# Altium schematic sheet [02] - IO.SchDoc
size A2
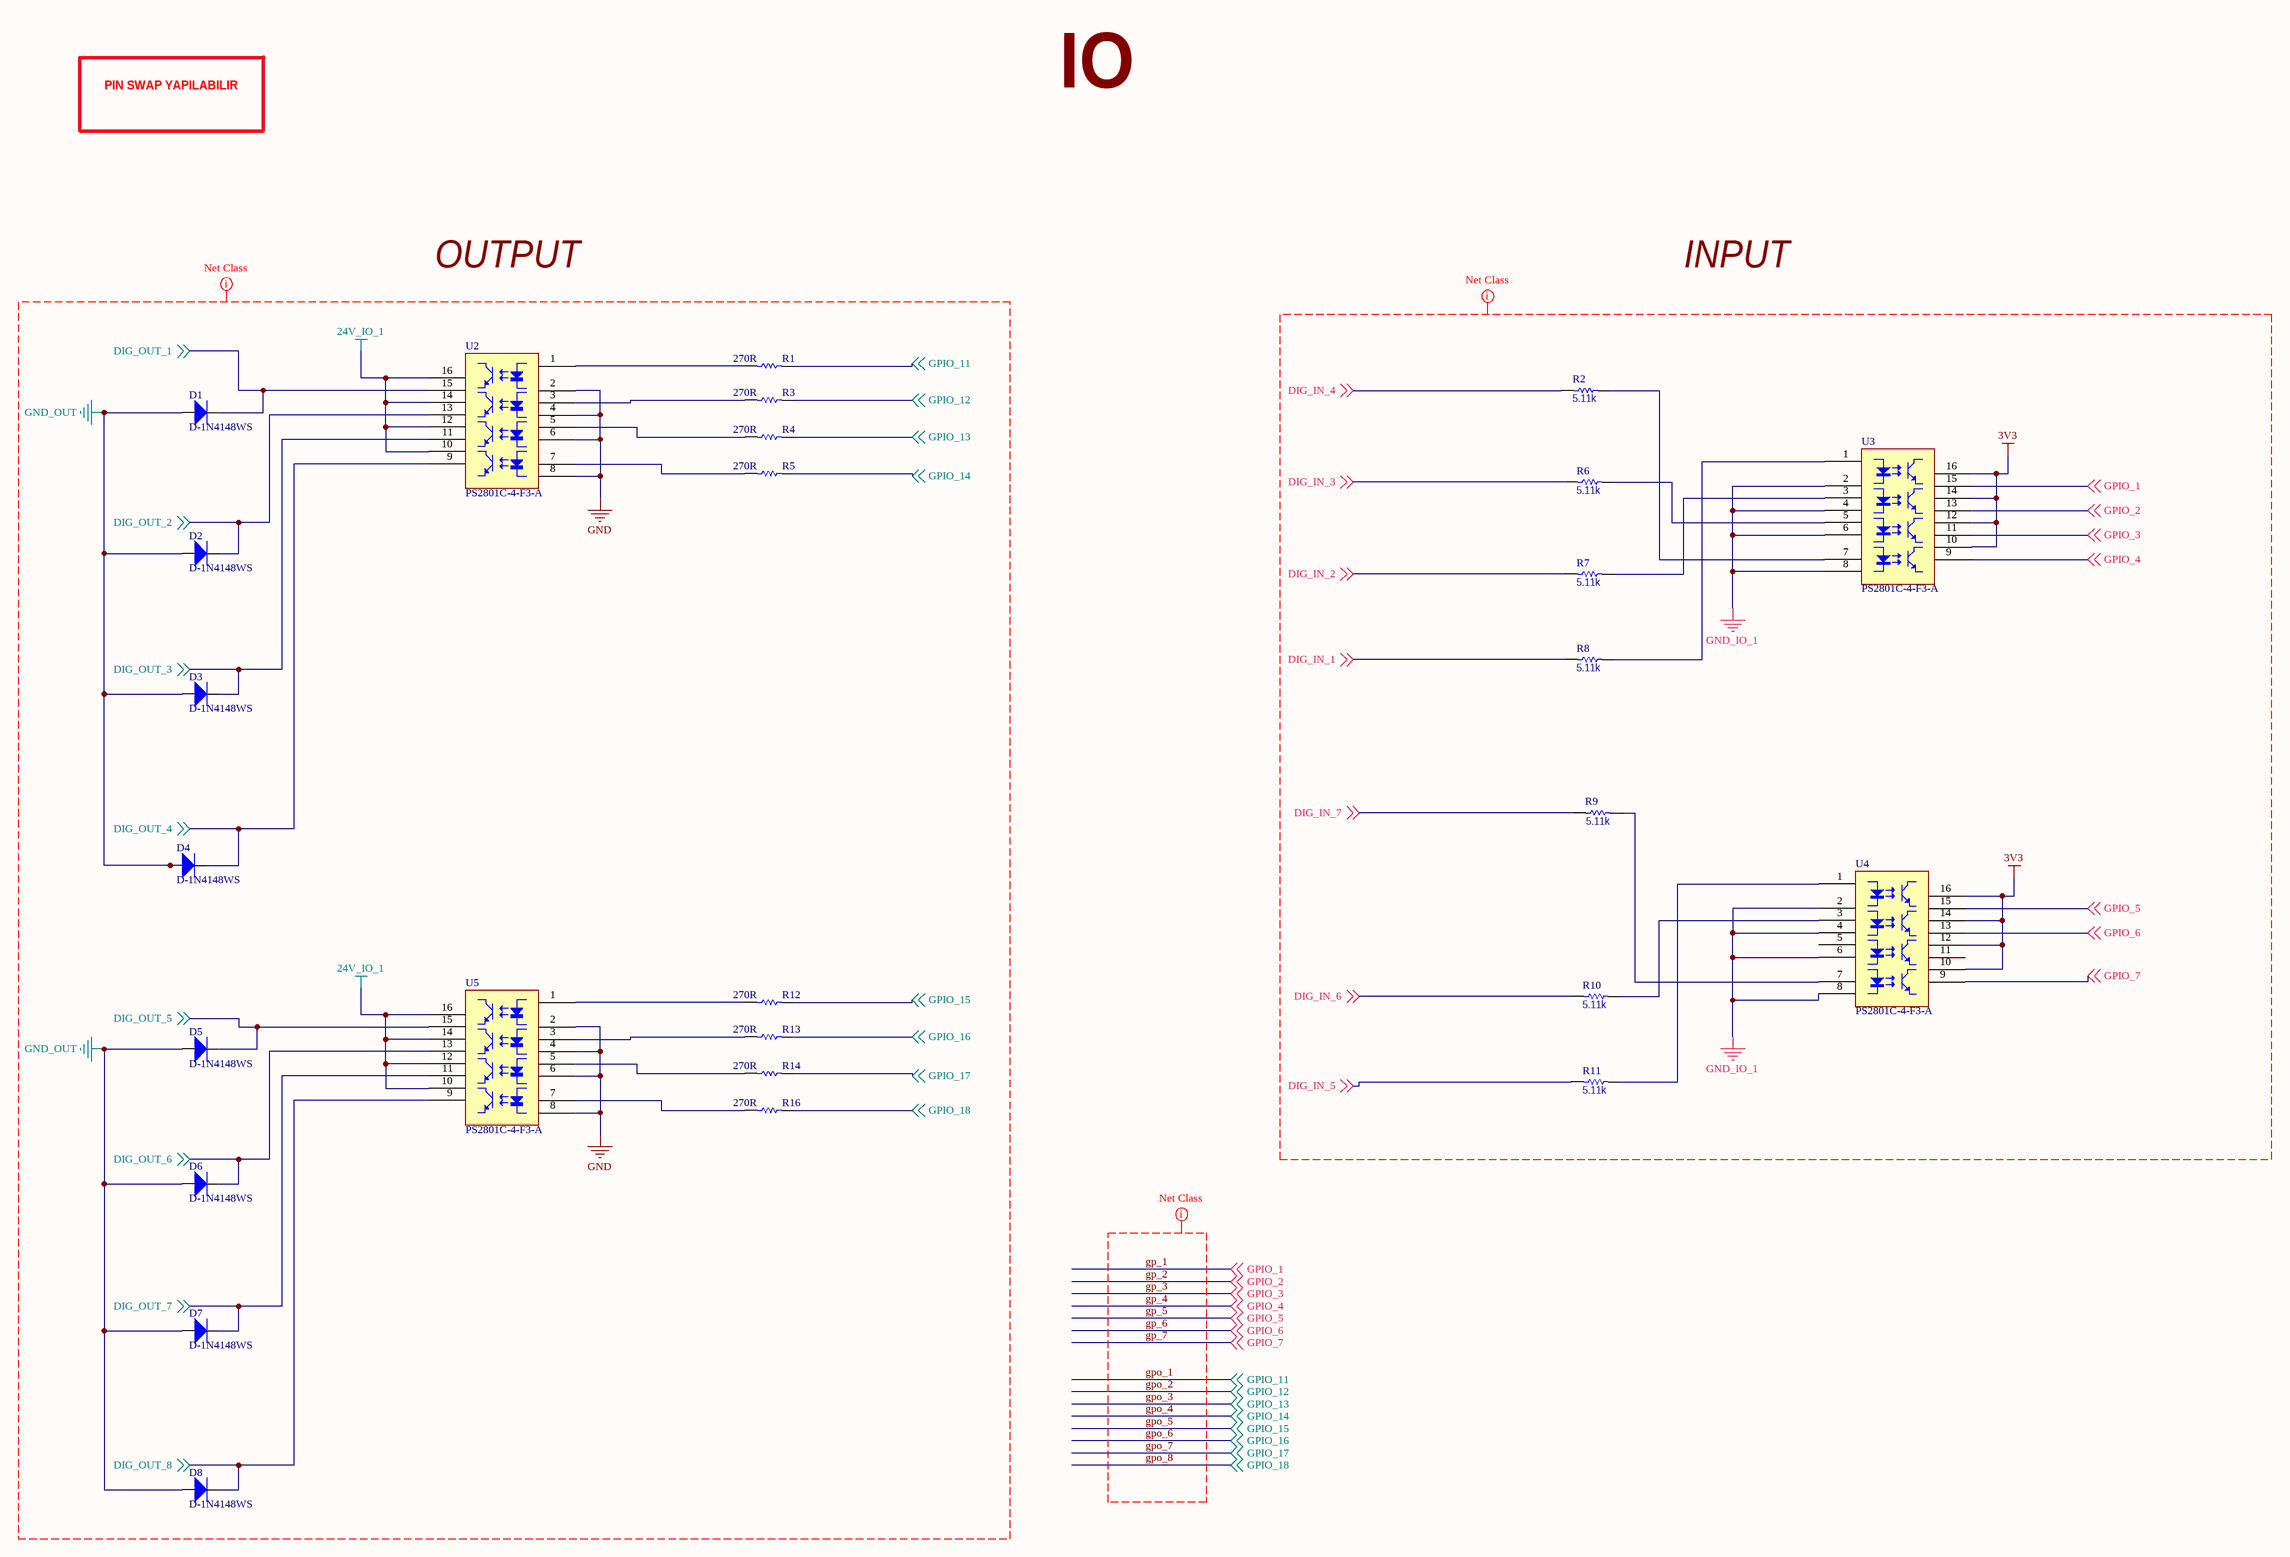
[diagram p0: [02] - IO.SchDoc]

## Parts
D1  D-1N4148WS  [SOD-323]
D2  D-1N4148WS  [SOD-323]
D3  D-1N4148WS  [SOD-323]
D4  D-1N4148WS  [SOD-323]
D5  D-1N4148WS  [SOD-323]
D6  D-1N4148WS  [SOD-323]
D7  D-1N4148WS  [SOD-323]
D8  D-1N4148WS  [SOD-323]
R1  270R  [R0805]
R2  Resistance (Ohms): 5.11k  [R1206]  (hidden comment: RES SMD 5.1K)
R3  270R  [R0805]
R4  270R  [R0805]
R5  270R  [R0805]
R6  Resistance (Ohms): 5.11k  [R1206]  (hidden comment: RES SMD 5.1K)
R7  Resistance (Ohms): 5.11k  [R1206]  (hidden comment: RES SMD 5.1K)
R8  Resistance (Ohms): 5.11k  [R1206]  (hidden comment: RES SMD 5.1K)
R9  Resistance (Ohms): 5.11k  [R1206]  (hidden comment: RES SMD 5.1K)
R10  Resistance (Ohms): 5.11k  [R1206]  (hidden comment: RES SMD 5.1K)
R11  Resistance (Ohms): 5.11k  [R1206]  (hidden comment: RES SMD 5.1K)
R12  270R  [R0805]
R13  270R  [R0805]
R14  270R  [R0805]
R16  270R  [R0805]
U2  PS2801C-4-F3-A  [U_16_D LONG]
U3  PS2801C-4-F3-A  [U_16_D LONG]
U4  PS2801C-4-F3-A  [U_16_D LONG]
U5  PS2801C-4-F3-A  [U_16_D LONG]

## Nets
3V3: U3.10 U3.12 U3.14 U3.16 U4.10 U4.12 U4.14 U4.16
24V_IO_1: U2.10 U2.12 U2.14 U2.16 U5.10 U5.12 U5.14 U5.16
GND: U2.2 U2.4 U2.6 U2.8 U5.2 U5.4 U5.6 U5.8
GND_IO_1: U3.2 U3.4 U3.6 U3.8 U4.2 U4.4 U4.6 U4.8
GND_OUT: D1.2 D2.2 D3.2 D4.2 D5.2 D6.2 D7.2 D8.2
DIG_IN_1: R8.1 ; off-sheet DIG_IN_1
DIG_IN_2: R7.1 ; off-sheet DIG_IN_2
DIG_IN_3: R6.1 ; off-sheet DIG_IN_3
DIG_IN_4: R2.1 ; off-sheet DIG_IN_4
DIG_IN_5: R11.1 ; off-sheet DIG_IN_5
DIG_IN_6: R10.1 ; off-sheet DIG_IN_6
DIG_IN_7: R9.1 ; off-sheet DIG_IN_7
DIG_OUT_1: D1.1 U2.15 ; off-sheet DIG_OUT_1
DIG_OUT_2: D2.1 U2.13 ; off-sheet DIG_OUT_2
DIG_OUT_3: D3.1 U2.11 ; off-sheet DIG_OUT_3
DIG_OUT_4: D4.1 U2.9 ; off-sheet DIG_OUT_4
DIG_OUT_5: D5.1 U5.15 ; off-sheet DIG_OUT_5
DIG_OUT_6: D6.1 U5.13 ; off-sheet DIG_OUT_6
DIG_OUT_7: D7.1 U5.11 ; off-sheet DIG_OUT_7
DIG_OUT_8: D8.1 U5.9 ; off-sheet DIG_OUT_8
gp_1: U3.15 ; off-sheet GPIO_1  [also labelled GPIO_1]
gp_2: U3.13 ; off-sheet GPIO_2  [also labelled GPIO_2]
gp_3: U3.11 ; off-sheet GPIO_3  [also labelled GPIO_3]
gp_4: U3.9 ; off-sheet GPIO_4  [also labelled GPIO_4]
gp_5: U4.15 ; off-sheet GPIO_5  [also labelled GPIO_5]
gp_6: U4.13 ; off-sheet GPIO_6  [also labelled GPIO_6]
gp_7: U4.9 ; off-sheet GPIO_7  [also labelled GPIO_7]
gpo_1: R1.2 ; off-sheet GPIO_11  [also labelled GPIO_11]
gpo_2: R3.2 ; off-sheet GPIO_12  [also labelled GPIO_12]
gpo_3: R4.2 ; off-sheet GPIO_13  [also labelled GPIO_13]
gpo_4: R5.2 ; off-sheet GPIO_14  [also labelled GPIO_14]
gpo_5: R12.2 ; off-sheet GPIO_15  [also labelled GPIO_15]
gpo_6: R13.2 ; off-sheet GPIO_16  [also labelled GPIO_16]
gpo_7: R14.2 ; off-sheet GPIO_17  [also labelled GPIO_17]
gpo_8: R16.2 ; off-sheet GPIO_18  [also labelled GPIO_18]
NetR1_1: R1.1 U2.1
NetR2_2: R2.2 U3.7
NetR3_1: R3.1 U2.3
NetR4_1: R4.1 U2.5
NetR5_1: R5.1 U2.7
NetR6_2: R6.2 U3.5
NetR7_2: R7.2 U3.3
NetR8_2: R8.2 U3.1
NetR9_2: R9.2 U4.7
NetR10_2: R10.2 U4.3
NetR11_2: R11.2 U4.1
NetR12_1: R12.1 U5.1
NetR13_1: R13.1 U5.3
NetR14_1: R14.1 U5.5
NetR16_1: R16.1 U5.7

Not connected (* = marked no-connect by the designer): U4 5 11

## Layout directives
net class stm_gpio: gp_1, gp_2, gp_3, gp_4, gp_5, gp_6, gp_7, gpo_1, gpo_2, gpo_3, gpo_4, gpo_5, gpo_6, gpo_7, gpo_8
net class Undefined: 3V3, 24V_IO_1, DIG_IN_1, DIG_IN_2, DIG_IN_3, DIG_IN_4, DIG_IN_5, DIG_IN_6, DIG_IN_7, DIG_OUT_1, DIG_OUT_2, DIG_OUT_3, DIG_OUT_4, DIG_OUT_5, DIG_OUT_6, DIG_OUT_7, DIG_OUT_8, GND, GND_IO_1, GND_OUT, GPIO_1, GPIO_2, GPIO_3, GPIO_4, GPIO_5, GPIO_6, GPIO_7, GPIO_11, GPIO_12, GPIO_13, GPIO_14, GPIO_15, GPIO_16, GPIO_17, GPIO_18

## Notes on the sheet
- PIN SWAP YAPILABILIR
- IO
- OUTPUT
- INPUT

## Library data of the parts
D1-D8 = D-1N4148WS: DIODES INC. - 1N4148WS-7-F - DIODE, SS SWITCH, 75V, 0.2W, SOD323; Diode Configuration: Single; Repetitive Reverse Voltage Vrrm Max: 75; Forward Current If(AV): 150; Forward Voltage VF Max: 1.25; Reverse Recovery Time trr Max: 4; Forward Surge Current Ifsm Max: 2; Product Range: 1N4148 Series; SVHC: No SVHC (17-Dec-2015); Diode Type: Switching; Supplier 1: Farnell; Manufacturer: DIODES INC.; Manufacturer Part Number: 1N4148WS-7-F; RoHS: YES; Stock 1: 52116; Pricing 1: 1=0.186, 25=0.142, 100=0.0928, 250=0.0514, 500=0.0433, 1000=0.0256, 3000=0.025, 8000=0.0239 (GBP); Operating Temperature Max: 150; Diode Case Style: SOD-323; No. of Pins: 2; Packaging: Cut Tape; MSL: MSL 1 - Unlimited; Operating Temperature Min: -65; Operating Temperature Range: -65°C to +150°C<!--FANDB--><div class="features-and-benefits-container"><div class="features-and-benefits-description"><span class="features-benefits-value">The 1N4148WS-7-F is a surface mount fast Switching Diode with matte tin-plated terminals and an UL94V-0 green molding compound molded plastic case. Solderable terminals as per MIL-STD-202, method 208 standard. Color band denotes cathode end polarity. It is suitable for general purpose switching applications.</span></div><div class="features-and-benefits-list"><ul class="features-and-benefits-list-list"><li class="features-and-benefits-list-item">Fast switching speed</li><li class="features-and-benefits-list-item">100V Non-repetitive peak reverse voltage</li><li class="features-and-benefits-list-item">53V RMS reverse voltage</li><li class="features-and-benefits-list-item">200mW Power dissipation</li><li class="features-and-benefits-list-item">625; ComponentLink1URL: http://www.farnell.com/datasheets/1911818.pdf; ComponentLink1Description: http://www.farnell.com/datasheets/1911818.pdf; Supplier Part Number 1: 1843678
R1 R3-R5 R12-R14 R16 = R-270R,0805: TE CONNECTIVITY / NEOHM 270R Thin Film; Manufacturer Part Number: CPF0805B270RE1; Product Range: TE CONNECTIVITY - CPF Series; Resistance: 270 Ohms; Power Rating: 100; Resistance Tolerance: ± 0.1%; Resistor Case Style: 0805 [2012 Metric]; Temperature Coefficient: ± 25; Voltage Rating: 200; External Depth: 0.5; External Length / Height: 2; External Width: 1.25; Resistor Mounting: SMD; Supplier 1: Farnell; Manufacturer: TE CONNECTIVITY / NEOHM; RoHS: YES; Stock 1: 755; Pricing 1: 10=0,43, 50=0,34, 100=0,32, 500=0,27, 1000=0,24 (EUR); Resistor Element Material: Thin Film; Packaging: Cut Tape; MSL: -; No. of Pins: 2; Operating Temperature Max: 155; Operating Temperature Min: -55; Operating Temperature Range: -55°C to +155; Series: CPF<!--FANDB--><div class="features-and-benefits-container"></div>; ComponentLink1URL: http://www.tycoelectronics.com/commerce/DocumentDelivery/DDEController?Action=srchrtrv&DocNm=1614884&DocType=Customer+Drawing&DocLang=English; ComponentLink1Description: http://www.tycoelectronics.com/commerce/DocumentDelivery/DDEController?Action=srchrtrv&DocNm=1614884&DocType=Customer+Drawing&DocLang=English; ComponentLink2URL: http://www.tycoelectronics.com/commerce/DocumentDelivery/DDEController?Action=srchrtrv&DocNm=1773200&DocType=Data+Sheet&DocLang=English; ComponentLink2Description: http://www.tycoelectronics.com/commerce/DocumentDelivery/DDEController?Action=srchrtrv&DocNm=1773200&DocType=Data+Sheet&DocLang=English; Supplier Part Number 1: 1697424
R2 R6-R11 = R-5.1K,1206: RES SMD 5.11K OHM 1% 1/2W 1206; Manufacturer: Stackpole Electronics Inc.; Manufacturer Part Number: RNCP1206FTD5K11; Power (Watts): 0.5W, 1/2W; Temperature Coefficient: ±100ppm/°C; Supplier 1: Digi-Key; RoHS: RoHS Compliant; Category: Resistors; Stock 1: 52805; Pricing 1: 1=0.1, 10=0.049, 50=0.0272, 100=0.0201, 250=0.01536, 500=0.01228, 1000=0.00904, 2500=0.00784 (USD); Packaging: Cut Tape (CT); Part Status: Active; Tolerance: ±1%; Composition: Thin Film; Features: Anti-Sulfur, Moisture Resistant; Operating Temperature: -55°C ~ 155°C; Package / Case: 1206 (3216 Metric); Supplier Device Package: 1206; Size / Dimension: 0.122" L x 0.059" W (3.10mm x 1.50mm); Height: 0.024" (0.60mm); Number of Terminations: 2; Failure Rate: -; ComponentLink1URL: http://www.seielect.com/catalog/SEI-RNCP.pdf; ComponentLink1Description: http://www.seielect.com/catalog/SEI-RNCP.pdf; Supplier Part Number 1: RNCP1206FTD5K11CT-ND
U2-U5 = PS2801C-4-F3-A: NEC - PS2801C-4-F3-A - OPTOCOUPLER, 4X TR O/P, SSOP-16; Supplier 1: Farnell; Supplier Part Number 1: 1682862